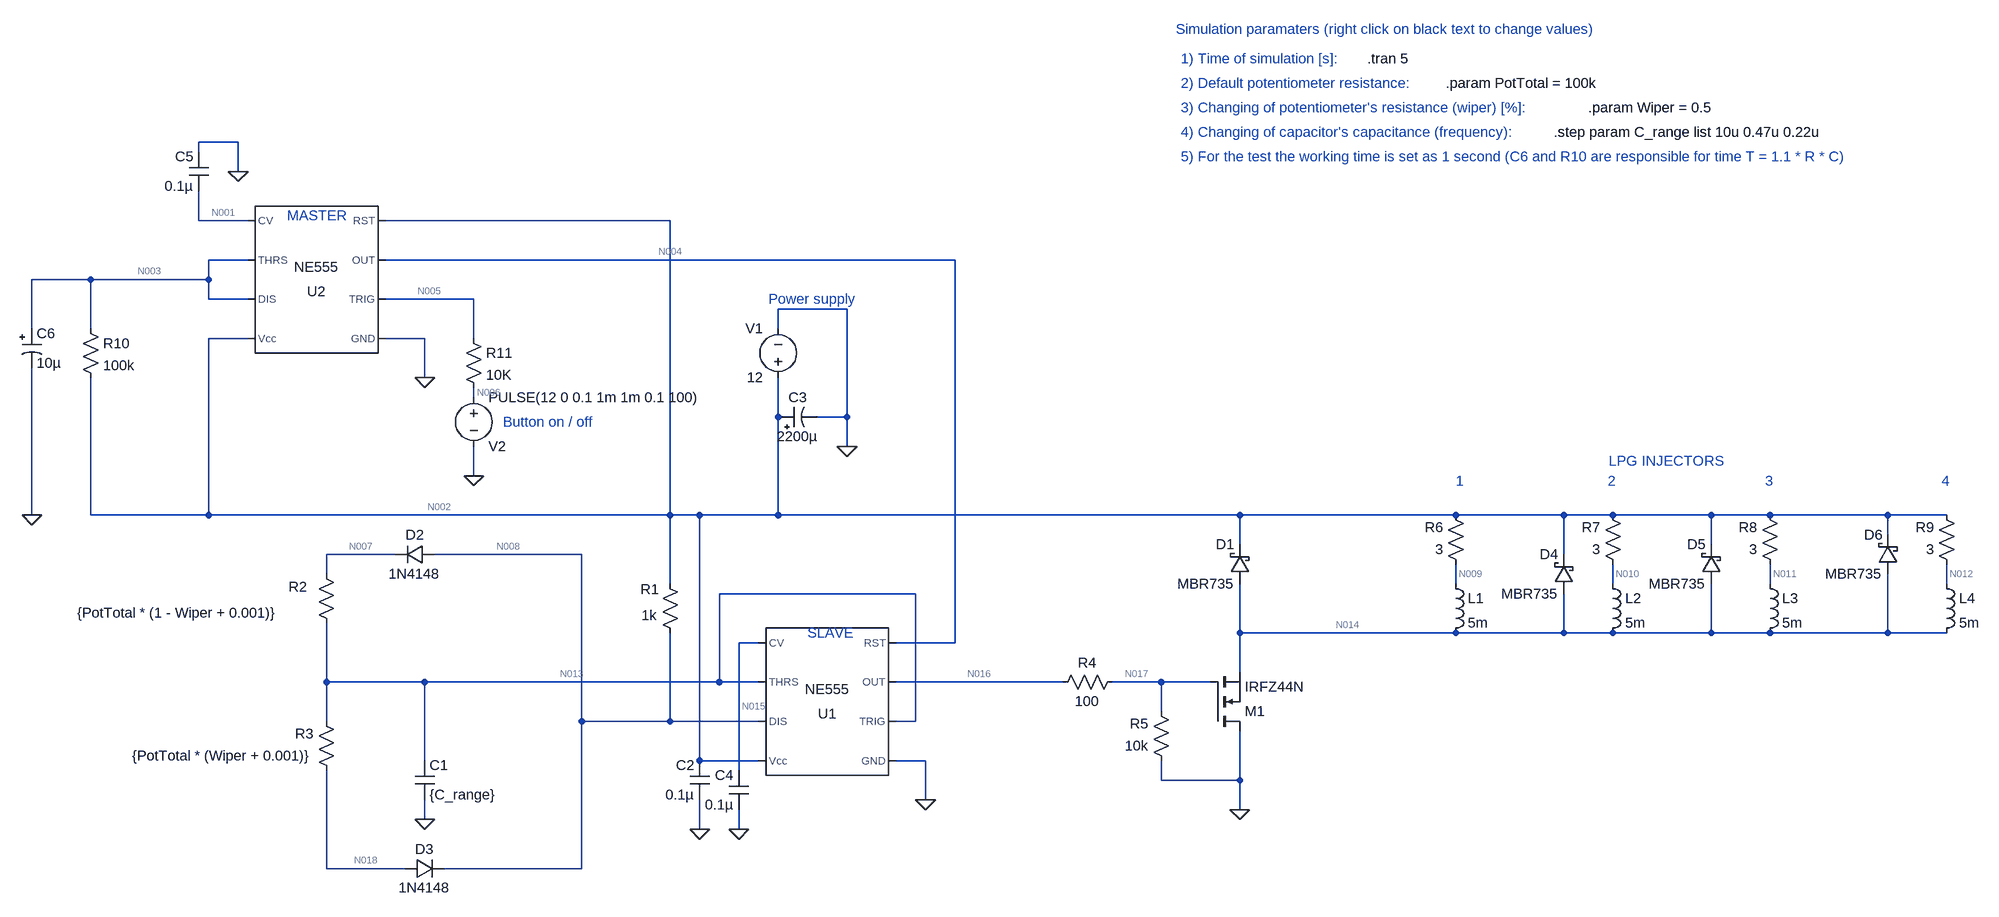
[diagram p0: schematic pulse_generator.asc]
pulse_generator.asc, the LTspice schematic file:
Version 4
SHEET 1 1532 900
WIRE -1312 -832 -1376 -832
WIRE -1376 -816 -1376 -832
WIRE -1312 -784 -1312 -832
WIRE -1376 -704 -1376 -752
WIRE -1296 -704 -1376 -704
WIRE -608 -704 -1072 -704
WIRE -1296 -640 -1360 -640
WIRE -144 -640 -1072 -640
WIRE -1552 -608 -1648 -608
WIRE -1360 -608 -1360 -640
WIRE -1360 -608 -1552 -608
WIRE -1360 -576 -1360 -608
WIRE -1296 -576 -1360 -576
WIRE -928 -576 -1072 -576
WIRE -320 -560 -432 -560
WIRE -1648 -528 -1648 -608
WIRE -1552 -528 -1552 -608
WIRE -432 -528 -432 -560
WIRE -1296 -512 -1360 -512
WIRE -1008 -512 -1072 -512
WIRE -928 -512 -928 -576
WIRE -1008 -448 -1008 -512
WIRE -928 -416 -928 -432
WIRE -432 -384 -432 -448
WIRE -320 -384 -320 -560
WIRE -320 -384 -368 -384
WIRE -320 -336 -320 -384
WIRE -928 -288 -928 -336
WIRE -1648 -224 -1648 -464
WIRE -1552 -224 -1552 -448
WIRE -1360 -224 -1360 -512
WIRE -1360 -224 -1552 -224
WIRE -608 -224 -608 -704
WIRE -608 -224 -1360 -224
WIRE -560 -224 -608 -224
WIRE -432 -224 -432 -384
WIRE -432 -224 -560 -224
WIRE 320 -224 -432 -224
WIRE 672 -224 320 -224
WIRE 848 -224 672 -224
WIRE 928 -224 848 -224
WIRE 1088 -224 928 -224
WIRE 1184 -224 1088 -224
WIRE 1376 -224 1184 -224
WIRE 1472 -224 1376 -224
WIRE 1376 -192 1376 -224
WIRE 320 -176 320 -224
WIRE 1088 -176 1088 -224
WIRE -1056 -160 -1168 -160
WIRE -752 -160 -992 -160
WIRE 848 -160 848 -224
WIRE -1168 -128 -1168 -160
WIRE -608 -112 -608 -224
WIRE 672 -112 672 -144
WIRE 928 -112 928 -144
WIRE 1184 -112 1184 -144
WIRE 1472 -112 1472 -144
WIRE -208 -96 -528 -96
WIRE 320 -32 320 -112
WIRE 672 -32 320 -32
WIRE 848 -32 848 -96
WIRE 848 -32 672 -32
WIRE 928 -32 848 -32
WIRE 1088 -32 1088 -112
WIRE 1088 -32 928 -32
WIRE 1184 -32 1088 -32
WIRE 1376 -32 1376 -128
WIRE 1376 -32 1184 -32
WIRE 1472 -32 1376 -32
WIRE -464 -16 -496 -16
WIRE -144 -16 -144 -640
WIRE -144 -16 -240 -16
WIRE 320 32 320 -32
WIRE -1168 48 -1168 -48
WIRE -1008 48 -1168 48
WIRE -528 48 -528 -96
WIRE -528 48 -1008 48
WIRE -464 48 -528 48
WIRE 32 48 -240 48
WIRE 192 48 112 48
WIRE 272 48 192 48
WIRE 192 96 192 48
WIRE -1168 112 -1168 48
WIRE -752 112 -752 -160
WIRE -608 112 -608 -32
WIRE -608 112 -752 112
WIRE -464 112 -608 112
WIRE -208 112 -208 -96
WIRE -208 112 -240 112
WIRE -1008 176 -1008 48
WIRE -560 176 -560 -224
WIRE -464 176 -560 176
WIRE -192 176 -240 176
WIRE -496 192 -496 -16
WIRE 192 208 192 176
WIRE 320 208 320 128
WIRE 320 208 192 208
WIRE -192 240 -192 176
WIRE 320 256 320 208
WIRE -1008 272 -1008 240
WIRE -560 288 -560 240
WIRE -496 288 -496 256
WIRE -1168 352 -1168 192
WIRE -1040 352 -1168 352
WIRE -752 352 -752 112
WIRE -752 352 -976 352
FLAG 320 256 0
FLAG -320 -336 0
FLAG -192 240 0
FLAG -560 288 0
FLAG -496 288 0
FLAG -1008 272 0
FLAG -1008 -448 0
FLAG -1312 -784 0
FLAG -1648 -224 0
FLAG -928 -288 0
SYMBOL Misc\\NE555 -352 80 R180
SYMATTR InstName U1
SYMBOL res -624 -128 R0
WINDOW 0 -32 25 Left 2
WINDOW 3 -31 67 Left 2
SYMATTR InstName R1
SYMATTR Value 1k
SYMBOL cap -1024 176 R0
SYMATTR InstName C1
SYMATTR Value {C_range}
SYMBOL voltage -432 -432 R180
WINDOW 0 24 96 Left 2
WINDOW 3 24 16 Left 2
WINDOW 123 0 0 Left 0
WINDOW 39 0 0 Left 0
SYMATTR InstName V1
SYMATTR Value 12
SYMBOL cap -544 240 R180
WINDOW 0 24 56 Left 2
WINDOW 3 24 8 Left 2
SYMATTR InstName C2
SYMATTR Value 0.1µ
SYMBOL schottky 336 -112 R180
WINDOW 0 24 64 Left 2
WINDOW 3 24 0 Left 2
SYMATTR InstName D1
SYMATTR Value MBR735
SYMATTR Description Diode
SYMATTR Type diode
SYMBOL nmos 272 128 M180
SYMATTR InstName M1
SYMATTR Value IRFZ44N
SYMBOL res 128 32 R90
WINDOW 0 0 56 VBottom 2
WINDOW 3 32 56 VTop 2
SYMATTR InstName R4
SYMATTR Value 100
SYMBOL res 208 192 R180
WINDOW 0 36 76 Left 2
WINDOW 3 36 40 Left 2
SYMATTR InstName R5
SYMATTR Value 10k
SYMBOL res 688 -128 R180
WINDOW 0 36 76 Left 2
WINDOW 3 36 40 Left 2
SYMATTR InstName R6
SYMATTR Value 3
SYMBOL ind 656 -128 R0
SYMATTR InstName L1
SYMATTR Value 5m
SYMBOL polcap -432 -368 R270
WINDOW 0 32 32 VTop 2
WINDOW 3 0 32 VBottom 2
SYMATTR InstName C3
SYMATTR Value 2200µ
SYMATTR SpiceLine V=25
SYMBOL res -1184 -144 R0
WINDOW 0 -46 37 Left 2
WINDOW 3 -390 79 Left 2
SYMATTR InstName R2
SYMATTR Value {PotTotal * (1 - Wiper + 0.001)}
SYMBOL res -1152 208 R180
WINDOW 0 36 76 Left 2
WINDOW 3 36 40 Left 2
SYMATTR InstName R3
SYMATTR Value {PotTotal * (Wiper + 0.001)}
SYMBOL diode -992 -176 R90
WINDOW 0 0 32 VBottom 2
WINDOW 3 32 32 VTop 2
SYMATTR InstName D2
SYMATTR Value 1N4148
SYMBOL diode -1040 368 R270
WINDOW 0 32 32 VTop 2
WINDOW 3 0 32 VBottom 2
SYMATTR InstName D3
SYMATTR Value 1N4148
SYMBOL cap -480 256 R180
WINDOW 0 24 56 Left 2
WINDOW 3 24 8 Left 2
SYMATTR InstName C4
SYMATTR Value 0.1µ
SYMBOL schottky 864 -96 R180
WINDOW 0 24 64 Left 2
WINDOW 3 24 0 Left 2
SYMATTR InstName D4
SYMATTR Value MBR735
SYMATTR Description Diode
SYMATTR Type diode
SYMBOL schottky 1104 -112 R180
WINDOW 0 24 64 Left 2
WINDOW 3 24 0 Left 2
SYMATTR InstName D5
SYMATTR Value MBR735
SYMATTR Description Diode
SYMATTR Type diode
SYMBOL schottky 1392 -128 R180
WINDOW 0 24 64 Left 2
WINDOW 3 24 0 Left 2
SYMATTR InstName D6
SYMATTR Value MBR735
SYMATTR Description Diode
SYMATTR Type diode
SYMBOL res 944 -128 R180
WINDOW 0 36 76 Left 2
WINDOW 3 36 40 Left 2
SYMATTR InstName R7
SYMATTR Value 3
SYMBOL res 1200 -128 R180
WINDOW 0 36 76 Left 2
WINDOW 3 36 40 Left 2
SYMATTR InstName R8
SYMATTR Value 3
SYMBOL res 1488 -128 R180
WINDOW 0 36 76 Left 2
WINDOW 3 36 40 Left 2
SYMATTR InstName R9
SYMATTR Value 3
SYMBOL ind 912 -128 R0
SYMATTR InstName L2
SYMATTR Value 5m
SYMBOL ind 1168 -128 R0
SYMATTR InstName L3
SYMATTR Value 5m
SYMBOL ind 1456 -128 R0
SYMATTR InstName L4
SYMATTR Value 5m
SYMBOL Misc\\NE555 -1184 -608 R180
SYMATTR InstName U2
SYMBOL cap -1360 -752 R180
WINDOW 0 24 56 Left 2
WINDOW 3 24 8 Left 2
SYMATTR InstName C5
SYMATTR Value 0.1µ
SYMBOL res -1568 -544 R0
SYMATTR InstName R10
SYMATTR Value 100k
SYMBOL polcap -1664 -528 R0
SYMATTR InstName C6
SYMATTR Value 10µ
SYMATTR SpiceLine V=25
SYMBOL res -944 -528 R0
SYMATTR InstName R11
SYMATTR Value 10K
SYMBOL voltage -928 -432 R0
WINDOW 0 24 96 Left 2
WINDOW 3 24 16 Left 2
WINDOW 123 0 0 Left 0
WINDOW 39 0 0 Left 0
SYMATTR InstName V2
SYMATTR Value PULSE(12 0 0.1 1m 1m 0.1 100)
TEXT 528 -968 Left 2 !.tran 5
TEXT 1112 -312 Right 2 ;LPG INJECTORS
TEXT 888 -888 Left 2 !.param Wiper = 0.5
TEXT 656 -928 Left 2 !.param PotTotal = 100k
TEXT 672 -280 Left 2 ;1
TEXT 920 -280 Left 2 ;2
TEXT 1176 -280 Left 2 ;3
TEXT 1464 -280 Left 2 ;4
TEXT 224 -968 Left 2 ;1) Time of simulation [s]:
TEXT 216 -1016 Left 2 ;Simulation paramaters (right click on black text to change values)
TEXT 224 -928 Left 2 ;2) Default potentiometer resistance:
TEXT 224 -888 Left 2 ;3) Changing of potentiometer's resistance (wiper) [%]:
TEXT -384 -32 Left 2 ;SLAVE
TEXT 224 -848 Left 2 ;4) Changing of capacitor's capacitance (frequency):
TEXT 832 -848 Left 2 !.step param C_range list 10u 0.47u 0.22u
TEXT -448 -576 Left 2 ;Power supply
TEXT -880 -376 Left 2 ;Button on / off
TEXT -1232 -712 Left 2 ;MASTER
TEXT 224 -808 Left 2 ;5) For the test the working time is set as 1 second (C6 and R10 are responsible for time T = 1.1 * R * C)

The netlist it stands for:
* pulse_generator.asc
XU1 0 N013 N016 N004 N015 N013 N008 N002 NE555  ; pins GND TRIG OUT RST CV THRS DIS Vcc
R1 N002 N008 1k
C1 N013 0 {C_range}
V1 N002 0 12
C2 0 N002 0.1µ
D1 N014 N002 MBR735
M1 0 N017 N014 N014 IRFZ44N
R4 N017 N016 100
R5 0 N017 10k
R6 N009 N002 3
L1 N009 N014 5m
C3 N002 0 2200µ V=25
R2 N007 N013 {PotTotal * (1 - Wiper + 0.001)}
R3 N018 N013 {PotTotal * (Wiper + 0.001)}
D2 N008 N007 1N4148
D3 N018 N008 1N4148
C4 0 N015 0.1µ
D4 N014 N002 MBR735
D5 N014 N002 MBR735
D6 N014 N002 MBR735
R7 N010 N002 3
R8 N011 N002 3
R9 N012 N002 3
L2 N010 N014 5m
L3 N011 N014 5m
L4 N012 N014 5m
XU2 0 N005 N004 N002 N001 N003 N003 N002 NE555  ; pins GND TRIG OUT RST CV THRS DIS Vcc
C5 N001 0 0.1µ
R10 N003 N002 100k
C6 N003 0 10µ V=25
R11 N005 N006 10K
V2 N006 0 PULSE(12 0 0.1 1m 1m 0.1 100)
.model D D
.lib standard.dio
.model NMOS NMOS
.model PMOS PMOS
.lib standard.mos
.tran 5
* LPG INJECTORS
.param Wiper = 0.5
.param PotTotal = 100k
* 1
* 2
* 3
* 4
* 1) Time of simulation [s]:
* Simulation paramaters (right click on black text to change values)
* 2) Default potentiometer resistance:
* 3) Changing of potentiometer's resistance (wiper) [%]:
* SLAVE
* 4) Changing of capacitor's capacitance (frequency):
.step param C_range list 10u 0.47u 0.22u
* Power supply
* Button on / off
* MASTER
* 5) For the test the working time is set as 1 second (C6 and R10 are responsible for time T = 1.1 * R * C)
.lib NE555.sub
.backanno
.end

* Results of the author's LTspice run, read from the files saved beside the schematic
* Operating Point (first step), zero values left out:
*   c_range = 220 n
*   V(n013) = 11.9 V
*   V(n015) = 8 V
*   V(n002) = 12 V
*   V(n008) = 12 V
*   V(n016) = 11.99 V
*   V(n004) = 12 V
*   V(n014) = 185.8 mV
*   V(n017) = 11.87 V
*   V(n009) = 189.7 mV
*   V(n007) = 11.9 V
*   V(n018) = 11.9 V
*   V(n010) = 189.7 mV
*   V(n011) = 189.7 mV
*   V(n012) = 189.7 mV
*   V(n005) = 12 V
*   V(n001) = 8 V
*   V(n003) = 12 V
*   V(n006) = 12 V
*   Id(M1) = -15.75 A
*   Is(M1) = 15.75 A
*   I(D1) = -159 µA
*   I(D4) = -159 µA
*   I(D5) = -159 µA
*   I(D6) = -159 µA
*   I(D2) = 21.53 nA
*   I(D3) = -2.262 nA
*   I(L1) = 3.937 A
*   I(L2) = 3.937 A
*   I(L3) = 3.937 A
*   I(L4) = 3.937 A
*   I(R1) = 39.81 nA
*   I(R4) = -1.187 mA
*   I(R5) = -1.187 mA
*   I(R6) = -3.937 A
*   I(R2) = 21.53 nA
*   I(R3) = 2.262 nA
*   I(R7) = -3.937 A
*   I(R8) = -3.937 A
*   I(R9) = -3.937 A
*   I(R10) = -28.01 nA
*   I(R11) = -12 nA
*   I(V1) = -15.76 A
*   I(V2) = -12 nA
*   Ix(u1:1) = -3.881 mA
*   Ix(u1:2) = 11.9 nA
*   Ix(u1:3) = -1.187 mA
*   Ix(u1:4) = 69.33 µA
*   Ix(u1:6) = 11.9 nA
*   Ix(u1:7) = 16.01 nA
*   Ix(u1:8) = 4.999 mA
*   Ix(u2:1) = -3.881 mA
*   Ix(u2:2) = 12 nA
*   Ix(u2:3) = -69.33 µA
*   Ix(u2:4) = 69.33 µA
*   Ix(u2:6) = 12 nA
*   Ix(u2:7) = 16.01 nA
*   Ix(u2:8) = 3.881 mA
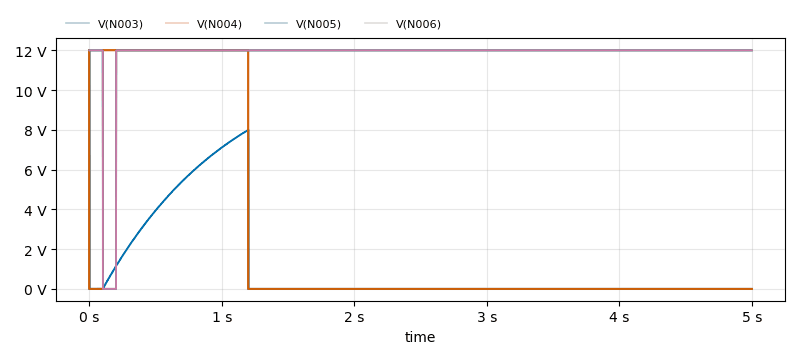
[diagram p1: Transient Analysis of pulse_generator.asc, plotted from the saved traces]
* Transient Analysis, 3 runs:
*   V(N003) [c_range=2.2e-07]: min 719.9 µV, max 12 V, average 1.038 V, rms 2.459 V, last 720 µV
*   V(N003) [c_range=4.7e-07]: min 719.9 µV, max 12 V, average 1.038 V, rms 2.459 V, last 720 µV
*   V(N003) [c_range=1e-05]: min 719.9 µV, max 12 V, average 1.038 V, rms 2.459 V, last 720 µV
*   V(N004) [c_range=2.2e-07]: min 2.472 mV, max 12 V, average 2.639 V, rms 5.626 V, last 2.472 mV
*   V(N004) [c_range=4.7e-07]: min 2.472 mV, max 12 V, average 2.639 V, rms 5.626 V, last 2.472 mV
*   V(N004) [c_range=1e-05]: min 2.472 mV, max 12 V, average 2.639 V, rms 5.626 V, last 2.472 mV
*   V(N005) [c_range=2.2e-07]: min 0 V, max 12 V, average 11.76 V, rms 11.88 V, last 12 V
*   V(N005) [c_range=4.7e-07]: min 0 V, max 12 V, average 11.76 V, rms 11.88 V, last 12 V
*   V(N005) [c_range=1e-05]: min 0 V, max 12 V, average 11.76 V, rms 11.88 V, last 12 V
*   V(N006) [c_range=2.2e-07]: min 0 V, max 12 V, average 11.76 V, rms 11.88 V, last 12 V
*   V(N006) [c_range=4.7e-07]: min 0 V, max 12 V, average 11.76 V, rms 11.88 V, last 12 V
*   V(N006) [c_range=1e-05]: min 0 V, max 12 V, average 11.76 V, rms 11.88 V, last 12 V